# Altium schematic sheet BLUETOOTH.SchDoc
size A
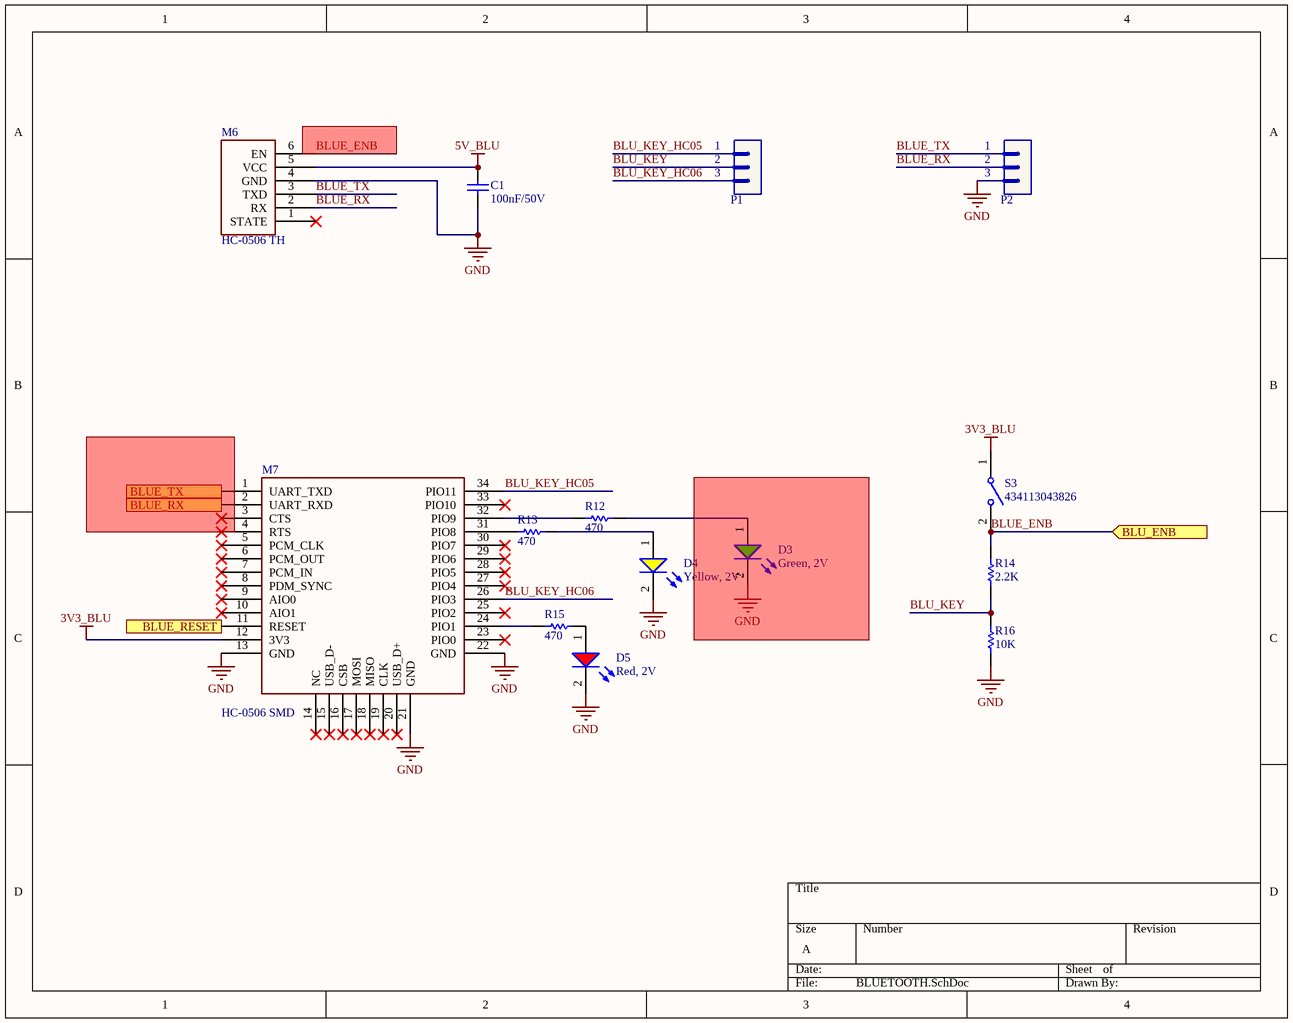
[diagram p0: BLUETOOTH.SchDoc]

## Parts
C1  value 100nF/50V  [CAP-SM-0805]  (hidden comment: Cap-100nF-50V-0805)
D3  value Green, 2V  [LED_0805_Blue]  (hidden comment: LED-GREEN-TH-3mm)
D4  value Yellow, 2V  [LED_0805_Blue]  (hidden comment: LED-YELLOW-TH-3mm)
D5  value Red, 2V  [LED_0805_Blue]  (hidden comment: LED-RED-TH-3mm)
M6  HC-0506 TH  [HC-0506 TH]
M7  HC-0506 SMD  [HC-0506 SMD]
P1  Header 3  [JP3]  (value not drawn)
P2  Header 3  [JP3]  (value not drawn)
R12  value 470  [RES-SM-0805]  (hidden comment: Res-470-0805)
R13  value 470  [RES-SM-0805]  (hidden comment: Res-470-0805)
R14  value 2.2K  [RES-SM-0805]  (hidden comment: Res-2.2K-0805)
R15  value 470  [RES-SM-0805]  (hidden comment: Res-470-0805)
R16  value 10K  [RES-SM-0805]  (hidden comment: Res-10k-0805)
S3  434113043826  [434113043826]

## Ports
BLU_ENB (in), BLUE_RESET (in), BLUE_RX (in), BLUE_TX (out)

## Nets
3V3_BLU: M7.12(3V3) S3.1
5V_BLU: C1.2 M6.5(VCC)
GND: C1.1 D3.2(K) D4.2(K) D5.2(K) M6.4(GND) M7.13(GND) M7.21(GND) M7.22(GND) P2.3 R16.1
BLU_KEY: P1.2 R14.1 R16.2
BLU_KEY_HC05: M7.34(PIO11) P1.1
BLU_KEY_HC06: M7.26(PIO3) P1.3
BLUE_ENB: M6.6(EN) R14.2 S3.2 ; port BLU_ENB
BLUE_RESET: M7.11(RESET) ; port BLUE_RESET
BLUE_RX: M6.2(RX) P2.2
BLUE_RX: M7.2(UART_RXD) ; port BLUE_RX  [a separate net that carries the same name]
BLUE_TX: M6.3(TXD) P2.1
BLUE_TX: M7.1(UART_TXD) ; port BLUE_TX  [a separate net that carries the same name]
NetD3_1: D3.1(A) R12.2
NetD4_1: D4.1(A) R13.2
NetD5_1: D5.1(A) R15.2
NetM7_24: M7.24(PIO1) R15.1
NetM7_31: M7.31(PIO8) R13.1
NetM7_32: M7.32(PIO9) R12.1

Not connected (* = marked no-connect by the designer): M6 1(STATE)*; M7 3(CTS)* 4(RTS)* 5(PCM_CLK)* 6(PCM_OUT)* 7(PCM_IN)* 8(PDM_SYNC)* 9(AIO0)* 10(AIO1)* 14(NC)* 15(USB_D-)* 16(CSB)* 17(MOSI)* 18(MISO)* 19(CLK)* 20(USB_D+)* 23(PIO0)* 25(PIO2)* 27(PIO4)* 28(PIO5)* 29(PIO6)* 30(PIO7)* 33(PIO10)*

## Library data of the parts
C1 = Cap-100nF-50V-0805: CAP CER 0.1UF 50V Y5V 0805; Manufacturer: Samsung Electro-Mechanics; Manufacturer Part Number: CL21F104ZBCNNNC; Local Supplier: thegioiic; Local Supplier Link: https://thegioiic.com/products/tu-100nf-0-1uf-50v-0805; Supplier 1: Digikey; Supplier 1 Part Number: 1276-1007-1-ND; Supplier 1 Link: https://www.digikey.com/product-detail/en/samsung-electro-mechanics/CL21F104ZBCNNNC/1276-1007-1-ND/3889093
D3 = LED-GREEN-TH-3mm: LED GREEN CLEAR T-1 T/H; Manufacturer: Kingbright; Manufacturer Part Number: WP710A10ZGC/G; Local Supplier: thegioiic; Local Supplier Link: https://thegioiic.com/products/led-xanh-la-3mm-chan-dai; Supplier 1: Digikey; Supplier 1 Link: https://www.digikey.com/product-detail/en/kingbright/WP710A10ZGC-G/754-1612-ND/2769684; Supplier 1 Part Number: 754-1612-ND
D5 = LED-RED-TH-3mm: LED RED CLEAR T-1 T/H; Manufacturer: Kingbright; Manufacturer Part Number: WP710A10SEC/J3; Local Supplier: thegioiic; Local Supplier Link: https://thegioiic.com/products/led-do-3mm-chan-dai; Supplier 1: Digikey; Supplier 1 Link: https://www.digikey.com/product-detail/en/kingbright/WP710A10SEC-J3/754-1589-ND/2769815; Supplier 1 Part Number: 754-1589-ND
P1 P2 = Header 3: Header, 3-Pin; LatestRevisionDate: 17-Jul-2002; LatestRevisionNote: Re-released for DXP Platform.; Publisher: Altium Limited
R12 R13 R15 = Res-470-0805: RES 470 OHM JUMPER 0805; Manufacturer: YAG6006CT-ND; Manufacturer Part Number: PE0805FRF7W0R047L; Local Supplier: thegioiic; Local Supplier Link: https://www.thegioiic.com/products/dien-tro-470-kohm-0805-5; Supplier 1: Digikey; Supplier 1 Link: https://www.digikey.com/product-detail/en/yageo/PE0805FRF7W0R047L/YAG6006CT-ND/9696460; Supplier 1 Part Number: YAG6006CT-ND
R14 = Res-2.2K-0805: RES SMD 2.2K OHM 1% 1/8W 0805; Manufacturer: TE Connectivity Passive Product; Manufacturer Part Number: CRG0805F2K2; Local Supplier: thegioiic; Local Supplier Link: https://thegioiic.com/products/dien-tro-2-2k-ohm-0805-5; Supplier 1: Digikey; Supplier 1 Link: https://www.digikey.com/product-detail/en/te-connectivity-passive-product/CRG0805F2K2/A106060CT-ND/3477706; Supplier 1 Part Number: A106060CT-ND
R16 = Res-10k-0805: RES 10K OHM 1% 1/4W 0805; Manufacturer: Stackpole Electronics Inc; Manufacturer Part Number: RNCP0805FTD10K0; Local Supplier: thegioiic; Local Supplier Link: https://thegioiic.com/products/dien-tro-10k-ohm-0805-5; Supplier 1: Digikey; Supplier 1 Link: https://www.digikey.com/product-detail/en/stackpole-electronics-inc/RNCP0805FTD10K0/RNCP0805FTD10K0CT-ND/2240601; Supplier 1 Part Number: RNCP0805FTD10K0CT-ND
S3 = 434113043826: WS-TASV J-Bend SMT Tact Switch 6x3.5mm, height 4.3mm, 260gf; Rated Voltage: 12VDC; Rated Current: 50mA; Washable: No; ComponentLink1Description: Manufacturer; ComponentLink1URL: http://www.we-online.de; ComponentLink2Description: Datasheet; ComponentLink2URL: https://katalog.we-online.com/em/datasheet/434113043826.pdf; Operating Temperature: -40 to +85degC; Part Number: 434113043826; Published Date: September 2019; Contact Material: Stainless Steel; Height: 4.3mm; Mounting Technology: SMT; Contact Plating: Silver; Operation Force: 260gf; Packaging: Tape and Reel; Terminal Material: Copper Alloy; Publisher: Wurth Elektronik; Terminal Plating: Silver
M6 = HC-0506 TH: Manufacturer Part Number: *; Manufacturer: *; Local Supplier Part Number: HS000882; Local Supplier Link: https://hshop.vn/products/mach-thu-phat-bluetooth-hc-05-do-ra-chon-master; Local Supplier: HShop
M7 = HC-0506 SMD: Local Supplier: HShop; Local Supplier Link: https://hshop.vn/products/mach-thu-phat-bluetooth-hc-05-chua-ra-chon-master; Local Supplier Part Number: HS000881; Manufacturer: *; Manufacturer Part Number: *